# EAGLE design ALU (EAGLE 9.6.2)
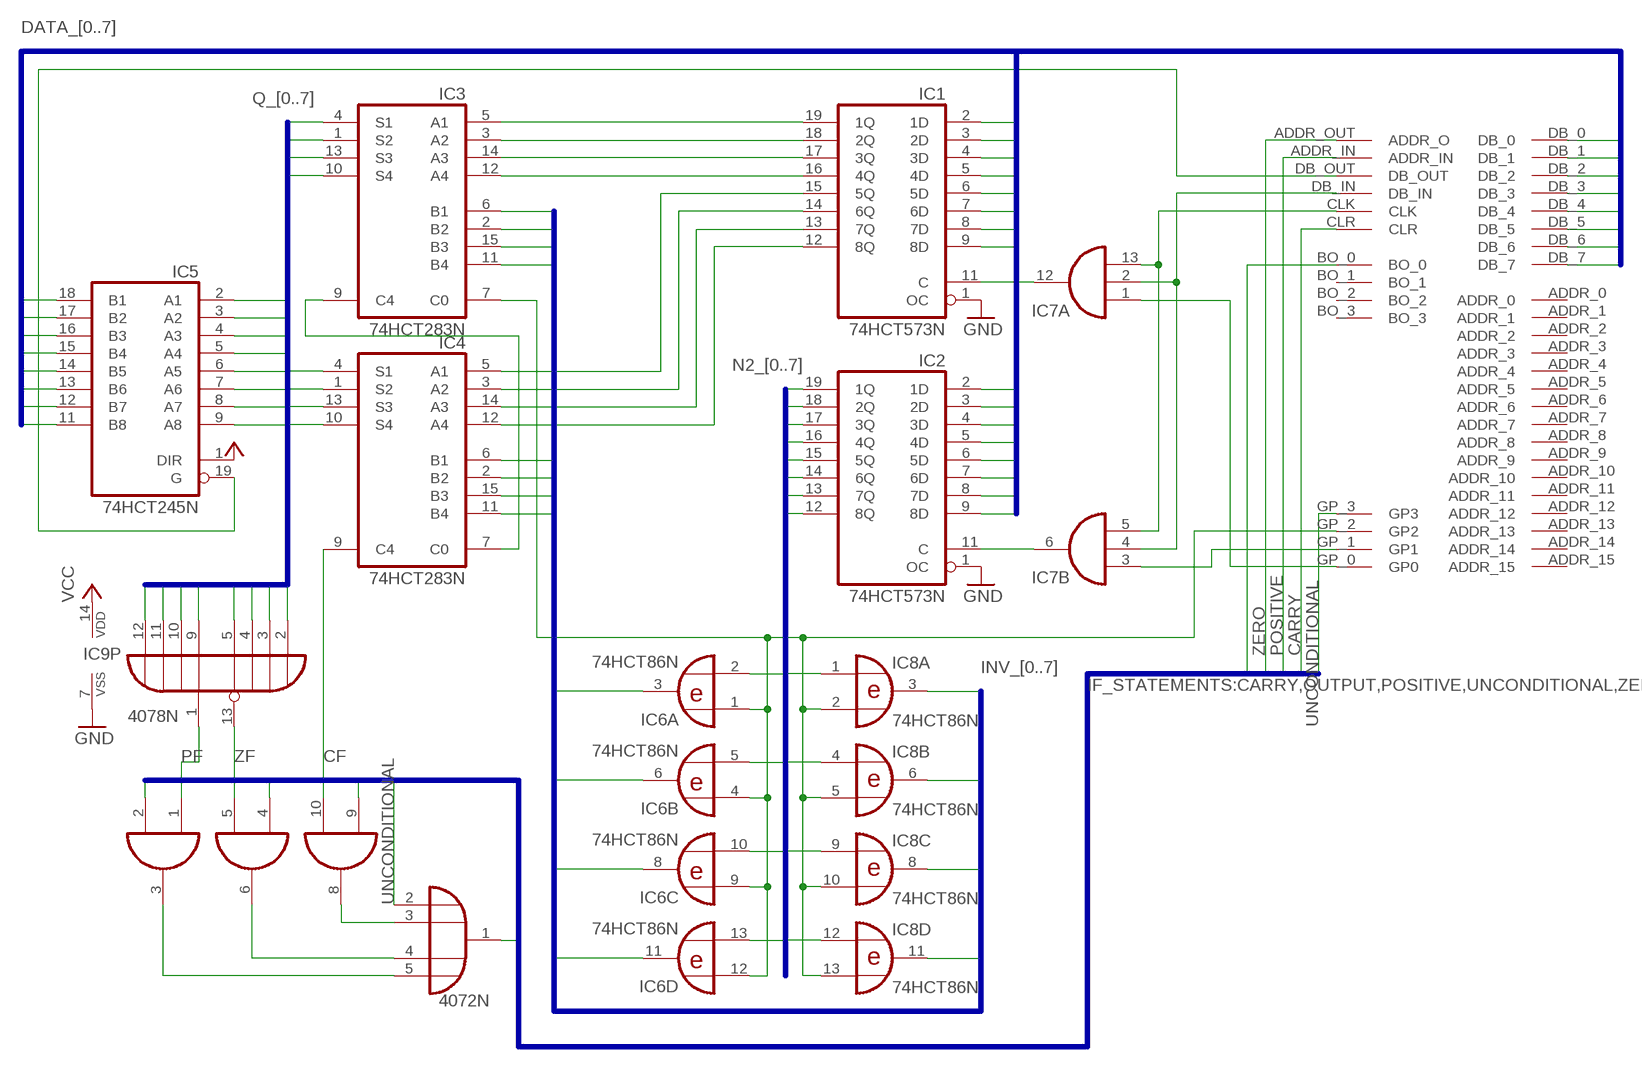
[diagram p0: schematic, sheet 1]

## Parts
IC1  74HCT573N  [DIL20]
IC2  74HCT573N  [DIL20]
IC3  74HCT283N  [DIL16]
IC4  74HCT283N  [DIL16]
IC5  74HCT245N  [DIL20]
IC6  74HCT86N  [DIL14]
IC7  74HCT11N  [DIL14]
IC8  74HCT86N  [DIL14]
IC9  4078N  [DIL14]
IC10  74HCT08N  [DIL14]
IC11  4072N  [DIL14]
U$1  BACKPLATE_INTERFACEEDGE_FINGER  [BACK_INTERFACE-FOOT]

## Nets
CARRY: IC10.9(C:I0) U$1.CLR
CF: IC4.9(C4) IC10.10(C:I1)
DATA_0: IC1.2(1D) IC2.2(1D) IC5.18(B1) U$1.DB_0
DATA_1: IC1.3(2D) IC2.3(2D) IC5.17(B2) U$1.DB_1
DATA_2: IC1.4(3D) IC2.4(3D) IC5.16(B3) U$1.DB_2
DATA_3: IC1.5(4D) IC2.5(4D) IC5.15(B4) U$1.DB_3
DATA_4: IC1.6(5D) IC2.6(5D) IC5.14(B5) U$1.DB_4
DATA_5: IC1.7(6D) IC2.7(6D) IC5.13(B6) U$1.DB_5
DATA_6: IC1.8(7D) IC2.8(7D) IC5.12(B7) U$1.DB_6
DATA_7: IC1.9(8D) IC2.9(8D) IC5.11(B8) U$1.DB_7
GND: IC1.1(OC) IC2.1(OC) IC9.7(VSS)
INV_0: IC3.6(B1) IC6.3(A:O)
INV_1: IC3.2(B2) IC6.6(B:O)
INV_2: IC3.15(B3) IC6.8(C:O)
INV_3: IC3.11(B4) IC6.11(D:O)
INV_4: IC4.6(B1) IC8.3(A:O)
INV_5: IC4.2(B2) IC8.6(B:O)
INV_6: IC4.15(B3) IC8.8(C:O)
INV_7: IC4.11(B4) IC8.11(D:O)
LOWER_BYTE_SIGNAL: IC7.1(A:I0) U$1.GP_0(GP0)
N2_0: IC2.19(1Q) IC6.2(A:I1)
N2_1: IC2.18(2Q) IC6.5(B:I1)
N2_2: IC2.17(3Q) IC6.10(C:I1)
N2_3: IC2.16(4Q) IC6.13(D:I1)
N2_4: IC2.15(5Q) IC8.1(A:I0)
N2_5: IC2.14(6Q) IC8.4(B:I0)
N2_6: IC2.13(7Q) IC8.9(C:I0)
N2_7: IC2.12(8Q) IC8.12(D:I0)
N$1: IC1.19(1Q) IC3.5(A1)
N$2: IC1.18(2Q) IC3.3(A2)
N$3: IC1.17(3Q) IC3.14(A3)
N$4: IC1.16(4Q) IC3.12(A4)
N$5: IC1.15(5Q) IC4.5(A1)
N$6: IC1.14(6Q) IC4.3(A2)
N$7: IC1.13(7Q) IC4.14(A3)
N$8: IC1.12(8Q) IC4.12(A4)
N$9: IC7.5(B:I2) IC7.13(A:I2) U$1.CLK
N$10: IC7.2(A:I1) IC7.4(B:I1) U$1.DB_IN
N$11: IC10.8(C:O) IC11.3(A:I1)
N$12: IC10.6(B:O) IC11.4(A:I2)
N$13: IC1.11(C) IC7.12(A:O)
N$14: IC2.11(C) IC7.6(B:O)
N$15: IC5.19(G) U$1.DB_OUT
N$16: IC10.3(A:O) IC11.5(A:I3)
N$17: IC3.9(C4) IC4.7(C0)
OUTPUT: IC11.1(A:O) U$1.BO_0
PF: IC9.1 IC10.1(A:I0)
POSITIVE: IC10.2(A:I1) U$1.ADDR_IN
Q_0: IC3.4(S1) IC5.2(A1) IC9.2(I0)
Q_1: IC3.1(S2) IC5.3(A2) IC9.3(I1)
Q_2: IC3.13(S3) IC5.4(A3) IC9.4(I2)
Q_3: IC3.10(S4) IC5.5(A4) IC9.5(I3)
Q_4: IC4.4(S1) IC5.6(A5) IC9.9(I4)
Q_5: IC4.1(S2) IC5.7(A6) IC9.10(I5)
Q_6: IC4.13(S3) IC5.8(A7) IC9.11(I6)
Q_7: IC4.10(S4) IC5.9(A8) IC9.12(I7)
SUBTRACT_MODE: IC3.7(C0) IC6.1(A:I0) IC6.4(B:I0) IC6.9(C:I0) IC6.12(D:I0) IC8.2(A:I1) IC8.5(B:I1) IC8.10(C:I1) IC8.13(D:I1) U$1.GP_2(GP2)
UNCONDITIONAL: IC11.2(A:I0) U$1.GP_3(GP3)
UPPER_BYTE_SIGNAL: IC7.3(B:I0) U$1.GP_1(GP1)
VCC: IC5.1(DIR) IC9.14(VDD)
ZERO: IC10.4(B:I0) U$1.ADDR_OUT(ADDR_O)
ZF: IC9.13(J) IC10.5(B:I1)
Unconnected: IC7.8(C:O) IC7.9(C:I0) IC7.10(C:I1) IC7.11(C:I2) IC10.11(D:O) IC10.12(D:I0) IC10.13(D:I1) IC11.9(B:I0) IC11.10(B:I1) IC11.11(B:I2) IC11.12(B:I3) IC11.13(B:O) U$1.ADDR_0 U$1.ADDR_1 U$1.ADDR_2 U$1.ADDR_3 U$1.ADDR_4 U$1.ADDR_5 U$1.ADDR_6 U$1.ADDR_7 U$1.ADDR_8 U$1.ADDR_9 U$1.ADDR_10 U$1.ADDR_11 U$1.ADDR_12 U$1.ADDR_13 U$1.ADDR_14 U$1.ADDR_15 U$1.BO_1 U$1.BO_2 U$1.BO_3 U$1.NC_0 U$1.NC_1 U$1.NC_2 U$1.NC_3 U$1.NC_4 U$1.NC_5 U$1.NC_6 U$1.NC_7 U$1.NC_8 U$1.NC_9 U$1.NC_10 U$1.NC_11 U$1.NC_12 U$1.NC_13 U$1.NC_14 U$1.NC_15 U$1.NC_16 U$1.NC_17 U$1.NC_18 U$1.NC_19 U$1.NC_20 U$1.NC_21

## Buses
DATA_[0..7]
N2_[0..7]
INV_[0..7]
Q_[0..7]
IF_STATEMENTS:CARRY,OUTPUT,POSITIVE,UNCONDITIONAL,ZERO

## Power pins joined to a net without a drawn wire
GND: IC1.10(GND) IC2.10(GND) IC3.8(GND) IC4.8(GND) IC5.10(GND) IC6.7(P:GND) IC7.7(P:GND) IC8.7(P:GND) IC10.7(P:GND) U$1.GND_0(GND) U$1.GND_1(GND)
VCC: IC1.20(VCC) IC2.20(VCC) IC3.16(VCC) IC4.16(VCC) IC5.20(VCC) IC6.14(P:VCC) IC7.14(P:VCC) IC8.14(P:VCC) IC10.14(P:VCC) U$1.VCC_0(VCC) U$1.VCC_1(VCC)
VDD: IC11.14(P:VDD)
VSS: IC11.7(P:VSS)

## Library data of the parts
IC1 IC2 = 74xx-eu:74*573: 8-bit D latch BUS DRIVER
IC3 IC4 = 74xx-eu:74*283: 4-bit binary FULL ADDER, fast carry
IC5 = 74xx-eu:74*245: Octal BUS TRANSCEIVER, 3-state
IC6 IC8 = 74xx-eu:74*86: Quad 2-input EXCLUSIVE-OR (XOR) gate
IC7 = 74xx-eu:74*11: Triple 3-input AND gate
IC9 = 40xx:4078: 8-input NOR
IC10 = 74xx-eu:74*08: Quad 2-input AND gate
IC11 = 40xx:4072: Dual 4-input OR
U$1 = Computer:BACKPLATE_INTERFACE

## Board
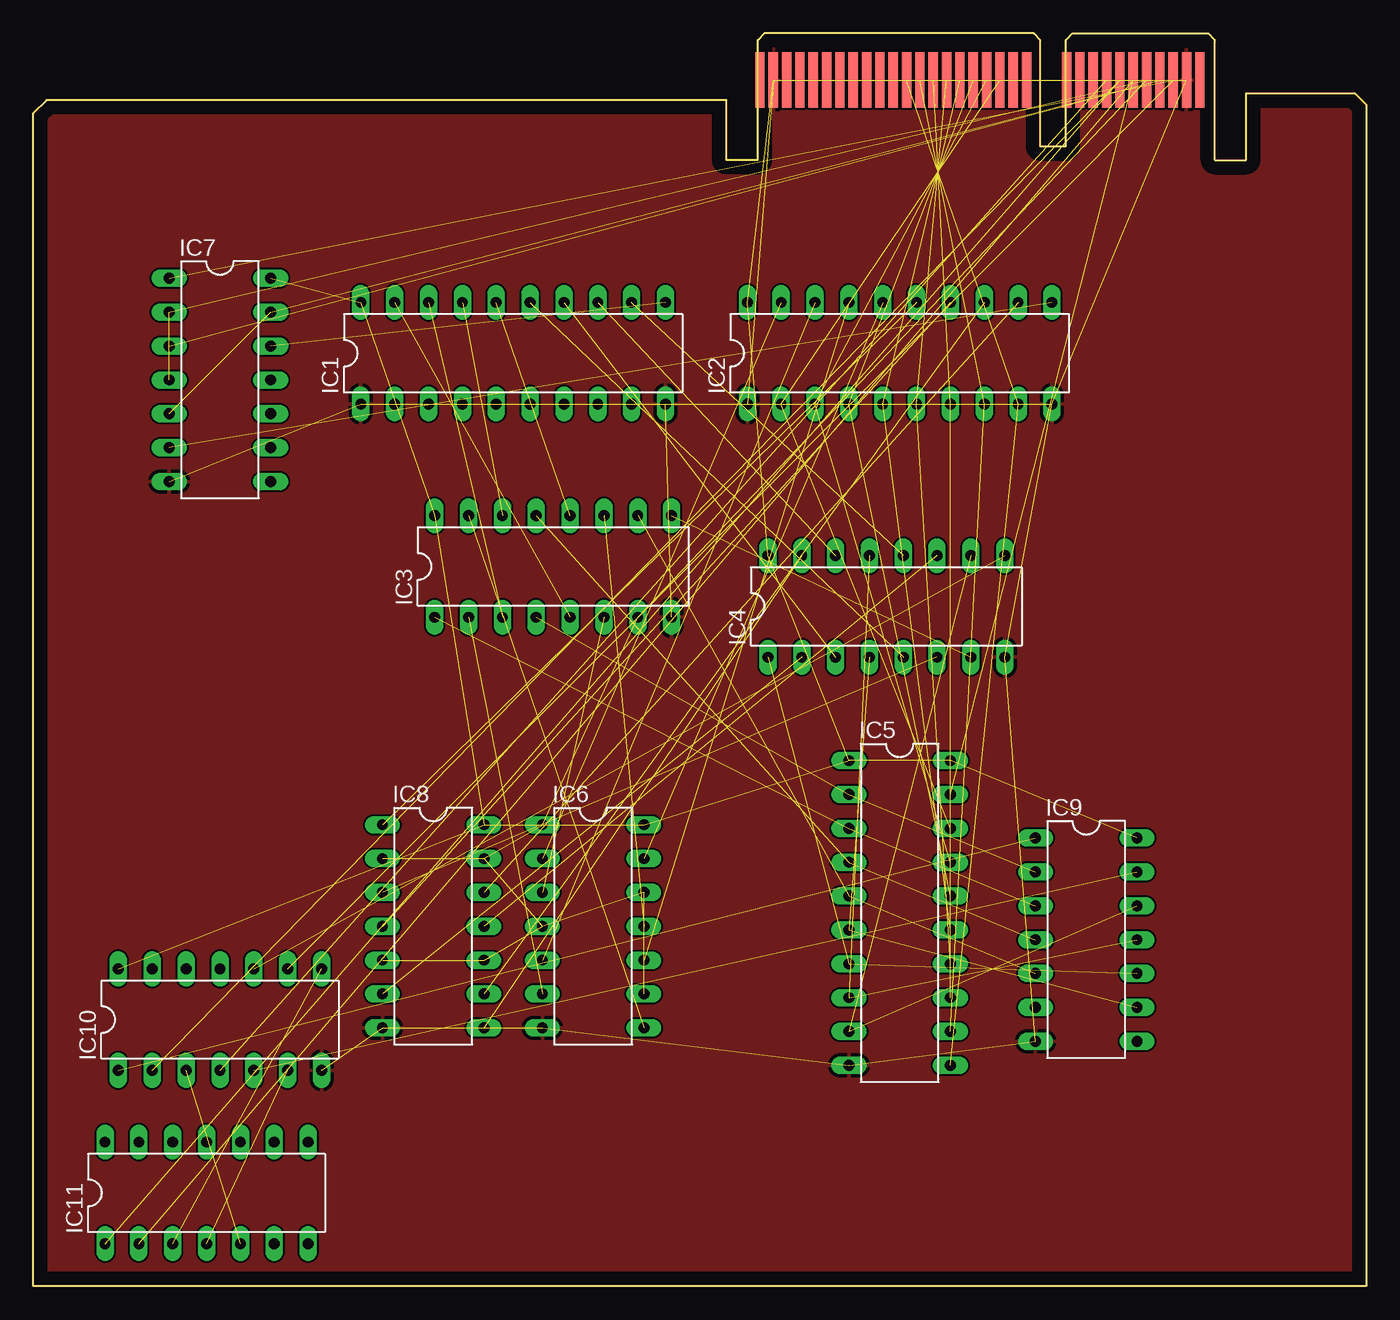
[diagram p1: board, top side]
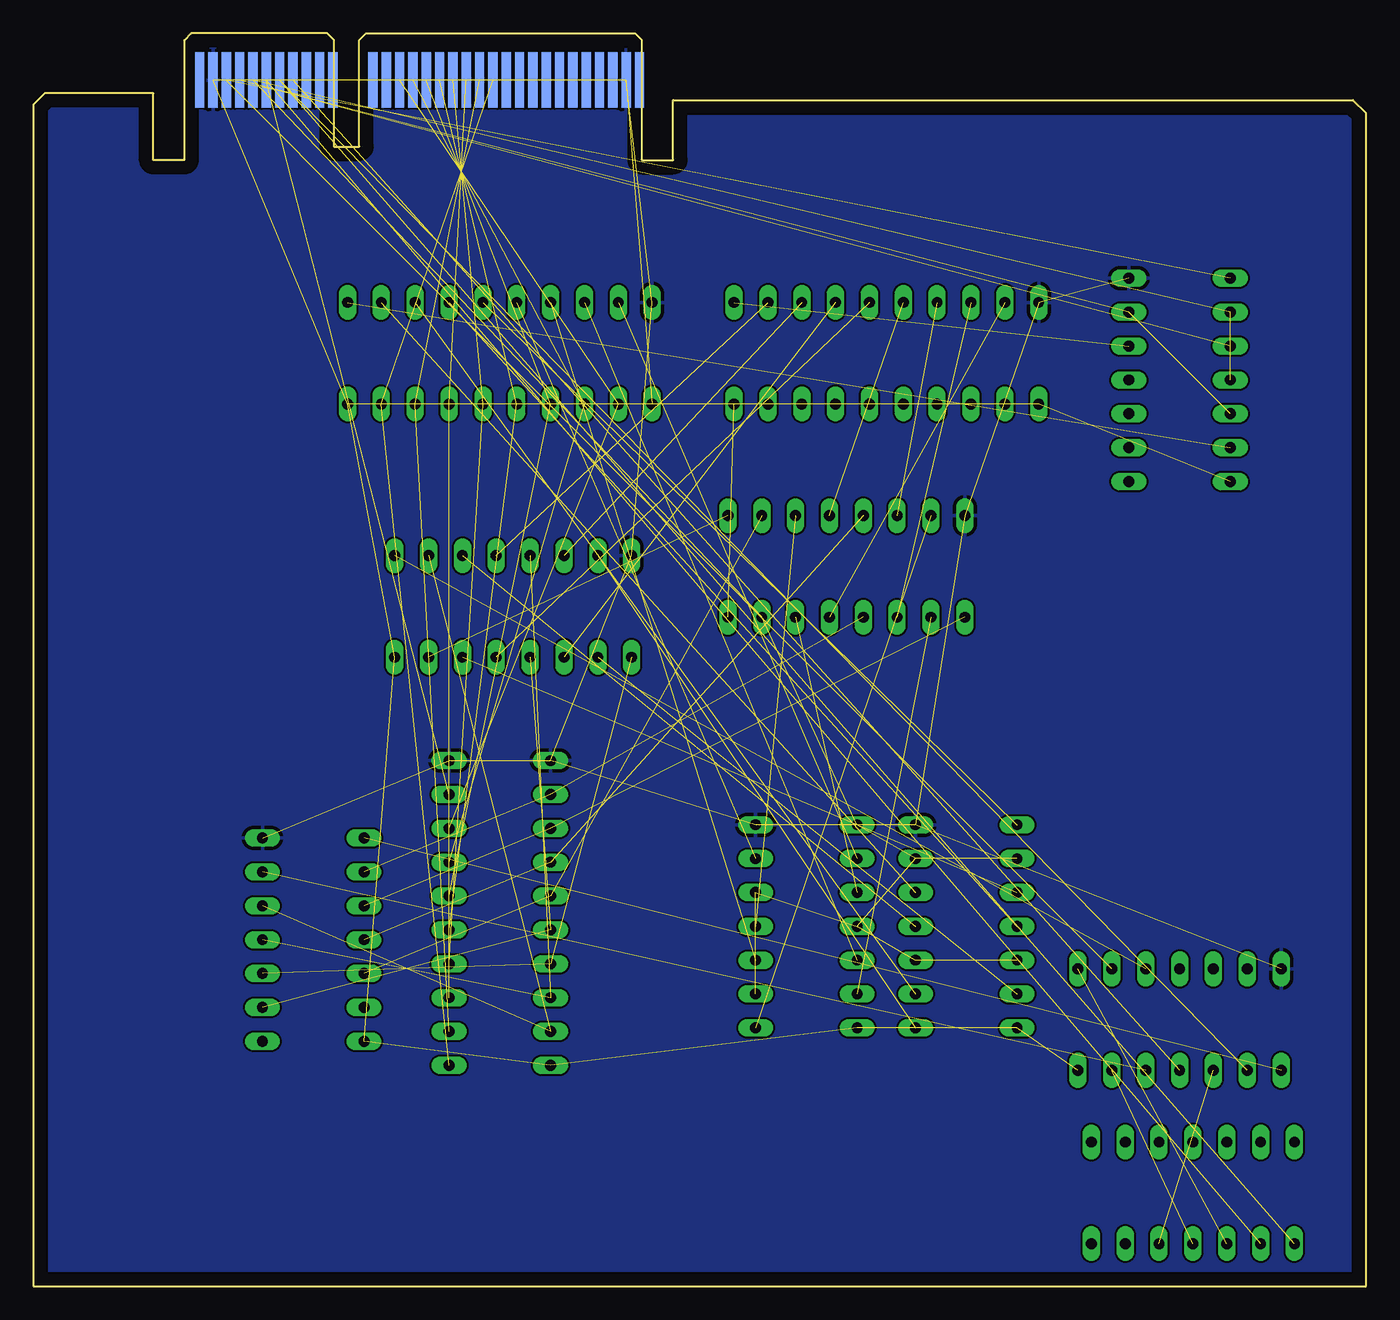
[diagram p2: board, bottom side, seen from below]

Size 100 x 94 mm. Coordinates in mm from the lower left corner, seen from the top.
Outline: 0,0 0,88 1,89 52,89 52,84.5 54.35,84.5 54.35,93.5 54.85,94 75.05,94 75.55,93.5 75.55,85.5 77.45,85.5 77.45,93.5 77.95,94 88.15,94 88.65,93.5 88.65,84.5 91,84.5 91,89.5 99.15,89.5 100,88.65 100,0 0,0
Copper layers (1*16): Top 0.035mm / dielectric 1.5mm / Bottom 0.035mm
Design rules "default": minimum track width 6mil, minimum drill 0.35mm, track to track 6mil, track to pad 6mil, pad to pad 6mil, via to via 6mil, smd to smd 6mil, copper to edge 40mil, drill to drill 6mil, minimum pad ring 10mil, minimum via ring 8mil, stop-mask expansion 4mil, vias tented up to drill 0mil, thermal gap 10mil

### Footprints (pad centres in the part's own frame; a part is rotated, then mirrored left to right if it is on the bottom)
DIL20 = drill 0.813 long: 1 -11.43,-3.81; 2 -8.89,-3.81; 3 -6.35,-3.81; 4 -3.81,-3.81; 5 -1.27,-3.81; 6 1.27,-3.81; 7 3.81,-3.81; 8 6.35,-3.81; 9 8.89,-3.81; 10 11.43,-3.81; 11 11.43,3.81; 12 8.89,3.81; 13 6.35,3.81; 14 3.81,3.81; 15 1.27,3.81; 16 -1.27,3.81; 17 -3.81,3.81; 18 -6.35,3.81; 19 -8.89,3.81; 20 -11.43,3.81
DIL16 = drill 0.813 long: 1 -8.89,-3.81; 2 -6.35,-3.81; 3 -3.81,-3.81; 4 -1.27,-3.81; 5 1.27,-3.81; 6 3.81,-3.81; 7 6.35,-3.81; 8 8.89,-3.81; 9 8.89,3.81; 10 6.35,3.81; 11 3.81,3.81; 12 1.27,3.81; 13 -1.27,3.81; 14 -3.81,3.81; 15 -6.35,3.81; 16 -8.89,3.81
DIL14 = drill 0.813 long: 1 -7.62,-3.81; 2 -5.08,-3.81; 3 -2.54,-3.81; 4 0,-3.81; 5 2.54,-3.81; 6 5.08,-3.81; 7 7.62,-3.81; 8 7.62,3.81; 9 5.08,3.81; 10 2.54,3.81; 11 0,3.81; 12 -2.54,3.81; 13 -5.08,3.81; 14 -7.62,3.81
BACK_INTERFACE-FOOT = smd 0.7 x 4.2: ADDR_0 17.02,0; ADDR_1 16.02,0; ADDR_2 15.02,0; ADDR_3 14.02,0; ADDR_4 13.02,0; ADDR_5 12.02,0; ADDR_6 11.02,0; ADDR_7 10.02,0; ADDR_8 9.02,0; ADDR_9 8.02,0; ADDR_10 7.02,0; ADDR_11 6.02,0; ADDR_12 5.02,0; ADDR_13 4.02,0; ADDR_14 3.02,0; ADDR_15 2.02,0; ADDR_IN 27.02,0; ADDR_OUT 26.02,0; CLK 30.02,0; CLR 31.02,0; DB_IN 29.02,0; DB_OUT 28.02,0; GND_0 32.02,0; GND_1 1.02,0; NC_0 33.02,0; NC_1 25.02,0; NC_2 24.02,0; NC_3 23.02,0; NC_4 20.02,0; NC_5 19.02,0; NC_6 18.02,0; NC_7 0.02,0 | smd 0.7 x 4.2 bottom: BO_0 27.02,0; BO_1 26.02,0; BO_2 25.02,0; BO_3 24.02,0; DB_0 18.02,0; DB_1 17.02,0; DB_2 16.02,0; DB_3 15.02,0; DB_4 14.02,0; DB_5 13.02,0; DB_6 12.02,0; DB_7 11.02,0; GP_0 31.02,0; GP_1 30.02,0; GP_2 29.02,0; GP_3 28.02,0; NC_8 33.02,0; NC_9 23.02,0; NC_10 20.02,0; NC_11 19.02,0; NC_12 10.02,0; NC_13 9.02,0; NC_14 8.02,0; NC_15 7.02,0; NC_16 6.02,0; NC_17 5.02,0; NC_18 4.02,0; NC_19 3.02,0; NC_20 2.02,0; NC_21 0.02,0; VCC_0 32.02,0; VCC_1 1.02,0

### Placement (x,y rotation side)
IC1  36,70 0 top
IC2  65,70 0 top
IC3  39,54 0 top
IC4  64,51 0 top
IC5  65,28 270 top
IC6  42,27 270 top
IC7  14,68 270 top
IC8  30,27 270 top
IC9  79,26 270 top
IC10  14,20 0 top
IC11  13,7 0 top
U$1  54.5,90.5 0 top

### Tracks (layer width: path | path; a pad name or v marks a point on that pad's centre or on a via)
CARRY  (1 unrouted)
CF  (1 unrouted)
DATA_0  (3 unrouted)
DATA_1  (3 unrouted)
DATA_2  (3 unrouted)
DATA_3  (3 unrouted)
DATA_4  (3 unrouted)
DATA_5  (3 unrouted)
DATA_6  (3 unrouted)
DATA_7  (3 unrouted)
GND  (13 unrouted)
  pour Top: 0,88 1,89 52,89 52,84.5 54.35,84.5 54.35,93.5 54.85,94 75.05,94 75.55,93.5 75.55,85.5 77.45,85.5 77.45,93.5 77.95,94 88.15,94 88.65,93.5 88.65,84.5 91,84.5 91,89.5 99.15,89.5 100,88.65 100,0 0,0
INV_0  (1 unrouted)
INV_1  (1 unrouted)
INV_2  (1 unrouted)
INV_3  (1 unrouted)
INV_4  (1 unrouted)
INV_5  (1 unrouted)
INV_6  (1 unrouted)
INV_7  (1 unrouted)
LOWER_BYTE_SIGNAL  (1 unrouted)
N2_0  (1 unrouted)
N2_1  (1 unrouted)
N2_2  (1 unrouted)
N2_3  (1 unrouted)
N2_4  (1 unrouted)
N2_5  (1 unrouted)
N2_6  (1 unrouted)
N2_7  (1 unrouted)
N$1  (1 unrouted)
N$2  (1 unrouted)
N$3  (1 unrouted)
N$4  (1 unrouted)
N$5  (1 unrouted)
N$6  (1 unrouted)
N$7  (1 unrouted)
N$8  (1 unrouted)
N$9  (2 unrouted)
N$10  (2 unrouted)
N$11  (1 unrouted)
N$12  (1 unrouted)
N$13  (1 unrouted)
N$14  (1 unrouted)
N$15  (1 unrouted)
N$16  (1 unrouted)
N$17  (1 unrouted)
OUTPUT  (1 unrouted)
PF  (1 unrouted)
POSITIVE  (1 unrouted)
Q_0  (2 unrouted)
Q_1  (2 unrouted)
Q_2  (2 unrouted)
Q_3  (2 unrouted)
Q_4  (2 unrouted)
Q_5  (2 unrouted)
Q_6  (2 unrouted)
Q_7  (2 unrouted)
SUBTRACT_MODE  (9 unrouted)
UNCONDITIONAL  (1 unrouted)
UPPER_BYTE_SIGNAL  (1 unrouted)
VCC  (12 unrouted)
  pour Bottom: 0,88 1,89 52,89 52,84.5 54.35,84.5 54.35,93.5 54.85,94 75.05,94 75.55,93.5 75.55,85.5 77.45,85.5 77.45,93.5 77.95,94 88.15,94 88.65,93.5 88.65,84.5 91,84.5 91,89.5 99.15,89.5 100,88.65 100,0 0,0
ZERO  (1 unrouted)
ZF  (1 unrouted)